# Altium schematic sheet Power_board_2024-08-19.schdoc
size 151 x 134 mm
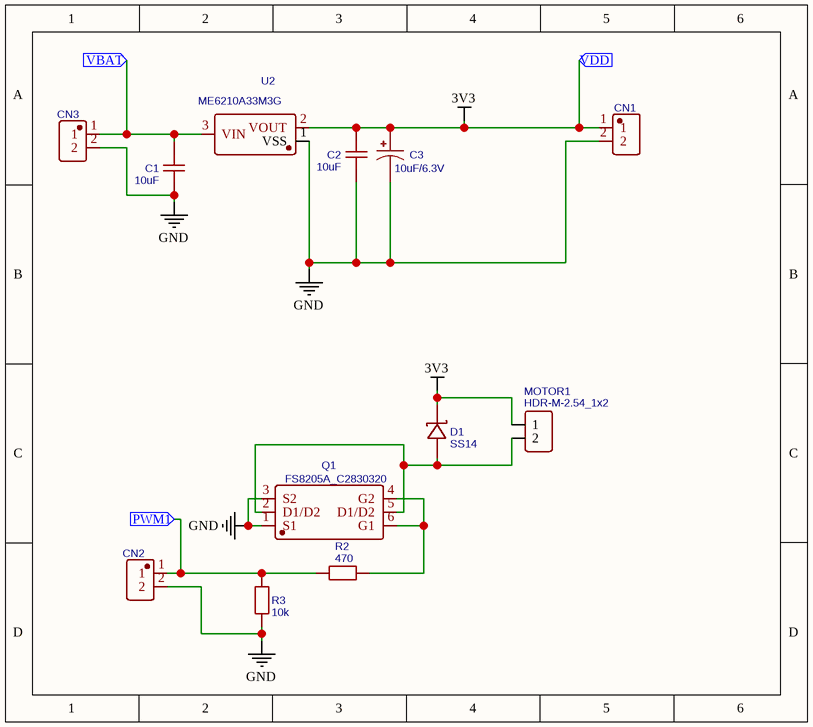
[diagram p0: Power_board_2024-08-19.schdoc]

## Parts
C1  10uF  [C0402]
C2  10uF  [C0402]
C3  10uF/6.3V  [CASE-R_2012]
CN1  KH-1.27FH-1X2P-H4.3  [HDR-TH_2P-P1.27-V-F]  (value not drawn)
CN2  KH-1.27FH-1X2P-H4.3  [HDR-TH_2P-P1.27-V-F]  (value not drawn)
CN3  KH-1.27FH-1X2P-H4.3  [HDR-TH_2P-P1.27-V-F]  (value not drawn)
D1  SS14  [SMA_L4.4-W2.8-LS5.4-RD]
MOTOR1  HDR-M-2.54_1x2  [HDR-M-2.54_1X2]
Q1  FS8205A_C2830320  [SOT-23-6_L2.9-W1.6-P0.95-LS2.8-BR]
R2  470  [R0402]
R3  10k  [R0402]
U2  ME6210A33M3G  [SOT-23-3_L3.0-W1.7-P0.95-LS2.9-BR]

## Ports
PWM1 (in), VBAT (in), VDD (in)

## Nets
3V3: C2.2 C3.1 CN1.1 D1.1(K) MOTOR1.1 U2.2(VOUT) ; port VDD
GND: C1.1 C2.1 C3.2 CN1.2 CN2.2 CN3.2 Q1.1(S1) Q1.3(S2) R3.1 U2.1(VSS)
PWM1: CN2.1 R2.1 R3.2 ; port PWM1
VBAT: C1.2 CN3.1 U2.3(VIN) ; port VBAT
NetD1_2: D1.2(A) MOTOR1.2 Q1.2(D1/D2) Q1.5(D1/D2)
NetQ1_4: Q1.4(G2) Q1.6(G1) R2.2

## Library data of the parts
C1 C2 = 10uF: nameAlias: Value(F); Contributor: LCEDA_Lib; spicePre: C; spiceSymbolName: C_0201_US
C3 = 10uF/6.3V: nameAlias: Value(F); Contributor: LCEDA_Lib; spicePre: C; spiceSymbolName: C_Tan_SMD_A_US
CN1-CN3 = KH-1.27FH-1X2P-H4.3: Manufacturer: kinghelm(金航标); Contributor: LCSC; Supplier: LCSC; Supplier Part: C2938380; Manufacturer Part: KH-1.27FH-1X2P-H4.3; JLCPCB Part Class: Extended Part; spicePre: U; spiceSymbolName: KH-1.27FH-1X2P-H4.3
D1 = SS14: BOM_Manufacturer: MDD; BOM_Supplier: LCSC; BOM_Manufacturer Part: SS14; BOM_Supplier Part: C2480; BOM_JLCPCB Part Class: Basic Part; spicePre: D; spiceSymbolName: SS14
MOTOR1 = HDR-M-2.54_1x2: Contributor: LCEDA_Lib; BOM_Supplier Part: C124375; BOM_Supplier: LCSC; spicePre: J; spiceSymbolName: HDR-M-2.54_1x2
Q1 = FS8205A_C2830320: BOM_Manufacturer: TECH PUBLIC(台舟电子); Contributor: LCSC; BOM_Supplier: LCSC; BOM_Supplier Part: C2830320; BOM_Manufacturer Part: FS8205A; BOM_JLCPCB Part Class: Extended Part; spicePre: Q; spiceSymbolName: FS8205A_C2830320
R2 = 470: nameAlias: Value(Ω); Contributor: LCEDA_Lib; spicePre: R; spiceSymbolName: R_0603_EU
R3 = 10k: nameAlias: Value(Ω); Contributor: LCEDA_Lib; spicePre: R; spiceSymbolName: R_0603_EU
U2 = ME6210A33M3G: Manufacturer: MICRONE(南京微盟); Contributor: LCSC; Supplier: LCSC; Supplier Part: C236680; Manufacturer Part: ME6210A33M3G; JLCPCB Part Class: Extended Part; spicePre: U; spiceSymbolName: ME6210A33M3G